# Altium schematic sheet TopLevel.SchDoc
size A
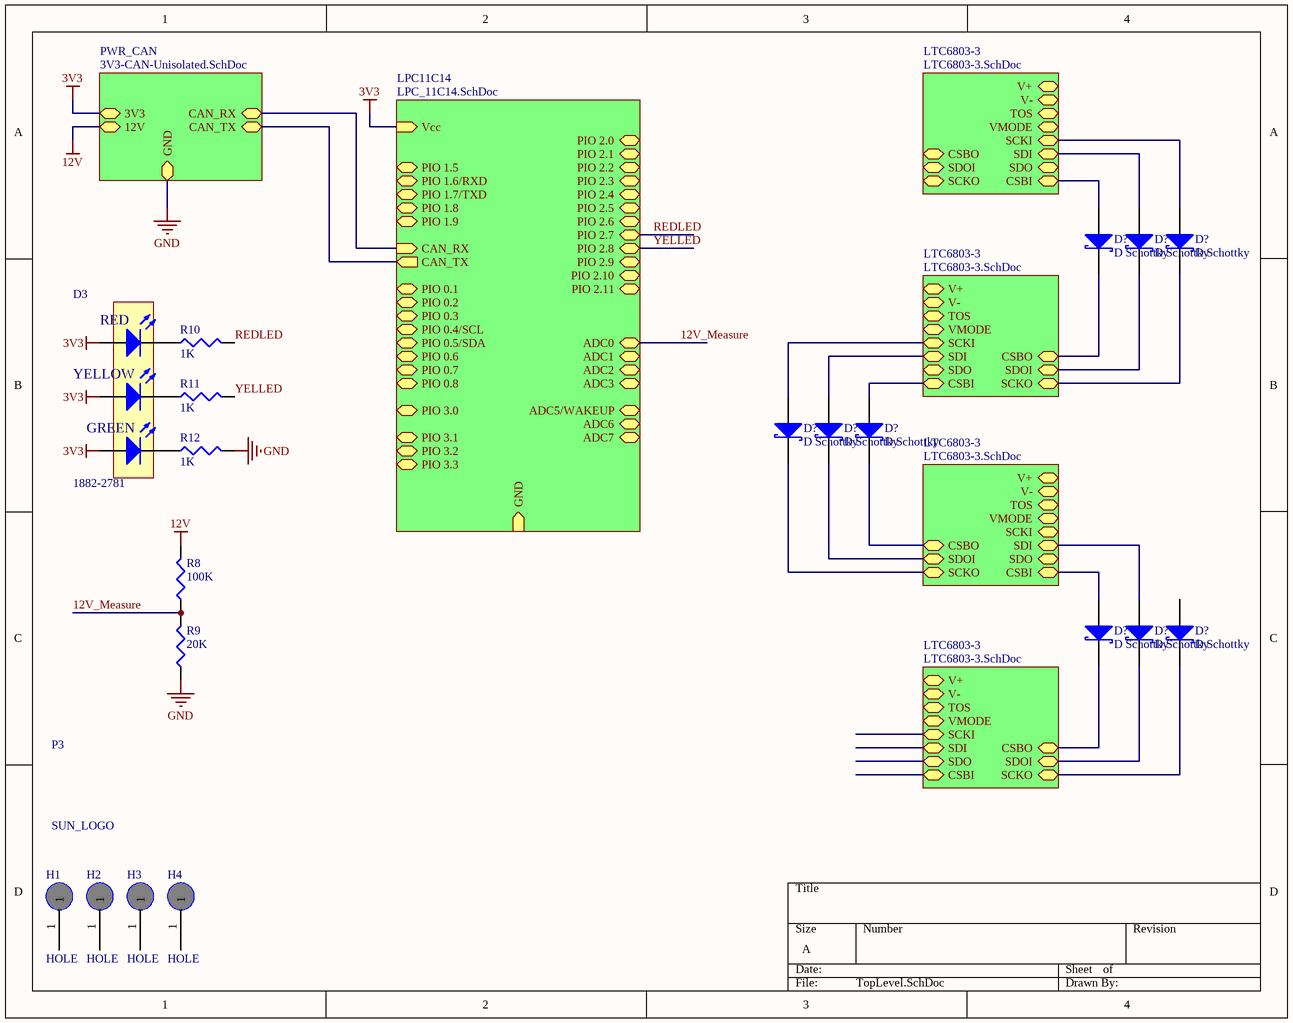
[diagram p0: TopLevel.SchDoc]

## Parts
(Parts that share a designator on the sheet are numbered #1, #2 ... from top to bottom, then left to right.)
D3  1882-2781  [LED_TRILEVEL]
D?#1  D Schottky  [SMB]
D?#2  D Schottky  [SMB]
D?#3  D Schottky  [SMB]
D?#4  D Schottky  [SMB]
D?#5  D Schottky  [SMB]
D?#6  D Schottky  [SMB]
D?#7  D Schottky  [SMB]
D?#8  D Schottky  [SMB]
D?#9  D Schottky  [SMB]
H1  HOLE  [M2.5]
H2  HOLE  [M2.5]
H3  HOLE  [M2.5]
H4  HOLE  [M2.5]
P3  SUN_LOGO  [SUNSWIFTLOGO]
R8  100K  [0603]
R9  20K  [0603]
R10  1K  [0603]
R11  1K  [0603]
R12  1K  [0603]

## Sub-sheets
LPC11C14 = LPC_11C14.SchDoc: ADC5/WAKEUP (bidir), ADC6 (bidir), CAN_TX (out), CAN_RX (in), ADC7, Vcc (in), GND (in), ADC3 (bidir), ADC2 (bidir), ADC1 (bidir), ADC0 (bidir), PIO 0.4/SCL (bidir), PIO 0.5/SDA (bidir), PIO 0.7 (bidir), PIO 0.6 (bidir), PIO 0.1 (bidir), PIO 0.2, PIO 0.3, PIO 0.8, PIO 1.6/RXD (bidir), PIO 1.7/TXD (bidir), PIO 1.5, PIO 1.8, PIO 1.9, PIO 3.0 (bidir), PIO 3.1 (bidir), PIO 3.2, PIO 3.3, PIO 2.9 (bidir), PIO 2.8 (bidir), PIO 2.7 (bidir), PIO 2.11 (bidir), PIO 2.10 (bidir), PIO 2.3 (bidir), PIO 2.2 (bidir), PIO 2.1 (bidir), PIO 2.6, PIO 2.0, PIO 2.4, PIO 2.5
LTC6803-3 = LTC6803-3.SchDoc: CSBI, SDO, SDI, SCKI, VMODE, TOS, V-, V+, SCKO, SDOI, CSBO
LTC6803-3 = LTC6803-3.SchDoc: CSBI, SDO, SDI, SCKI, VMODE, TOS, V-, V+, SCKO, SDOI, CSBO
LTC6803-3 = LTC6803-3.SchDoc: CSBI, SDO, SDI, SCKI, VMODE, TOS, V-, V+, SCKO, SDOI, CSBO
LTC6803-3 = LTC6803-3.SchDoc: CSBI, SDO, SDI, SCKI, VMODE, TOS, V-, V+, SCKO, SDOI, CSBO
PWR_CAN = 3V3-CAN-Unisolated.SchDoc: CAN_RX (bidir), CAN_TX (bidir), 3V3 (bidir), 12V (bidir), GND (bidir)

## Nets
3V3: D3.4(A) D3.5(A) D3.6(A) ; sheet PWR_CAN/3V3, sheet LPC11C14/Vcc
12V: R8.2 ; sheet PWR_CAN/12V
GND: R9.1 R12.2 ; sheet PWR_CAN/GND
12V_Measure: R8.1 R9.2 ; sheet LPC11C14/ADC0
REDLED: R10.2 ; sheet LPC11C14/PIO 2.7
YELLED: R11.2 ; sheet LPC11C14/PIO 2.8
NetD3_1: D3.1(K) R12.1
NetD3_2: D3.2(K) R11.1
NetD3_3: D3.3(K) R10.1
NetD?#1_1: D?#1.1(A) ; sheet LTC6803-3/CSBI
NetD?#1_2: D?#1.2(K) ; sheet LTC6803-3/CSBO
NetD?#2_1: D?#2.1(A) ; sheet LTC6803-3/SDI
NetD?#2_2: D?#2.2(K) ; sheet LTC6803-3/SDOI
NetD?#3_1: D?#3.1(A) ; sheet LTC6803-3/SCKI
NetD?#3_2: D?#3.2(K) ; sheet LTC6803-3/SCKO
NetD?#4_1: D?#4.1(A) ; sheet LTC6803-3/SCKI
NetD?#4_2: D?#4.2(K) ; sheet LTC6803-3/SCKO
NetD?#5_1: D?#5.1(A) ; sheet LTC6803-3/SDI
NetD?#5_2: D?#5.2(K) ; sheet LTC6803-3/SDOI
NetD?#6_1: D?#6.1(A) ; sheet LTC6803-3/CSBI
NetD?#6_2: D?#6.2(K) ; sheet LTC6803-3/CSBO
NetD?#7_1: D?#7.1(A) ; sheet LTC6803-3/CSBI
NetD?#7_2: D?#7.2(K) ; sheet LTC6803-3/CSBO
NetD?#8_1: D?#8.1(A) ; sheet LTC6803-3/SDI
NetD?#8_2: D?#8.2(K) ; sheet LTC6803-3/SDOI
NetD?#9_2: D?#9.2(K) ; sheet LTC6803-3/SCKO
(unnamed): sheet PWR_CAN/CAN_RX, sheet LPC11C14/CAN_RX
(unnamed): sheet PWR_CAN/CAN_TX, sheet LPC11C14/CAN_TX

Not connected (* = marked no-connect by the designer): D?#9 1(A); H1 1; H2 1; H3 1; H4 1

## Notes on the sheet
- (in symbol LED-TRILEVEL) RED; YELLOW; GREEN

## Library data of the parts
D3 = LED-TRILEVEL: Three level LED; Needed?: Farnell - Low Stock; Farnell: 1461596; Farnell Price: 4.56
D?#1-D?#9 = D Schottky: Schottky Diode; Published: 8-Jun-2000; LatestRevisionDate: 17-Jul-2002; LatestRevisionNote: Re-released for DXP Platform.; PackageReference: SMB; Publisher: Altium Limited; PackageDescription: DO-214-AA/SMB; 2 C-Bend Leads; Body 5.3 x 3.6 mm, inc. leads (LxW); Code_JEDEC: DO-214-AA
H1-H4 = HOLE: Needed?: NO - Footprint
R8-R12 = RES1: Resistor; Needed?: NO - HW LAB
  R8: Value: 100k
  R9: Value: 20k
  R10-R12: Value: 1k